# EAGLE design startlamp (EAGLE 8.3.2)
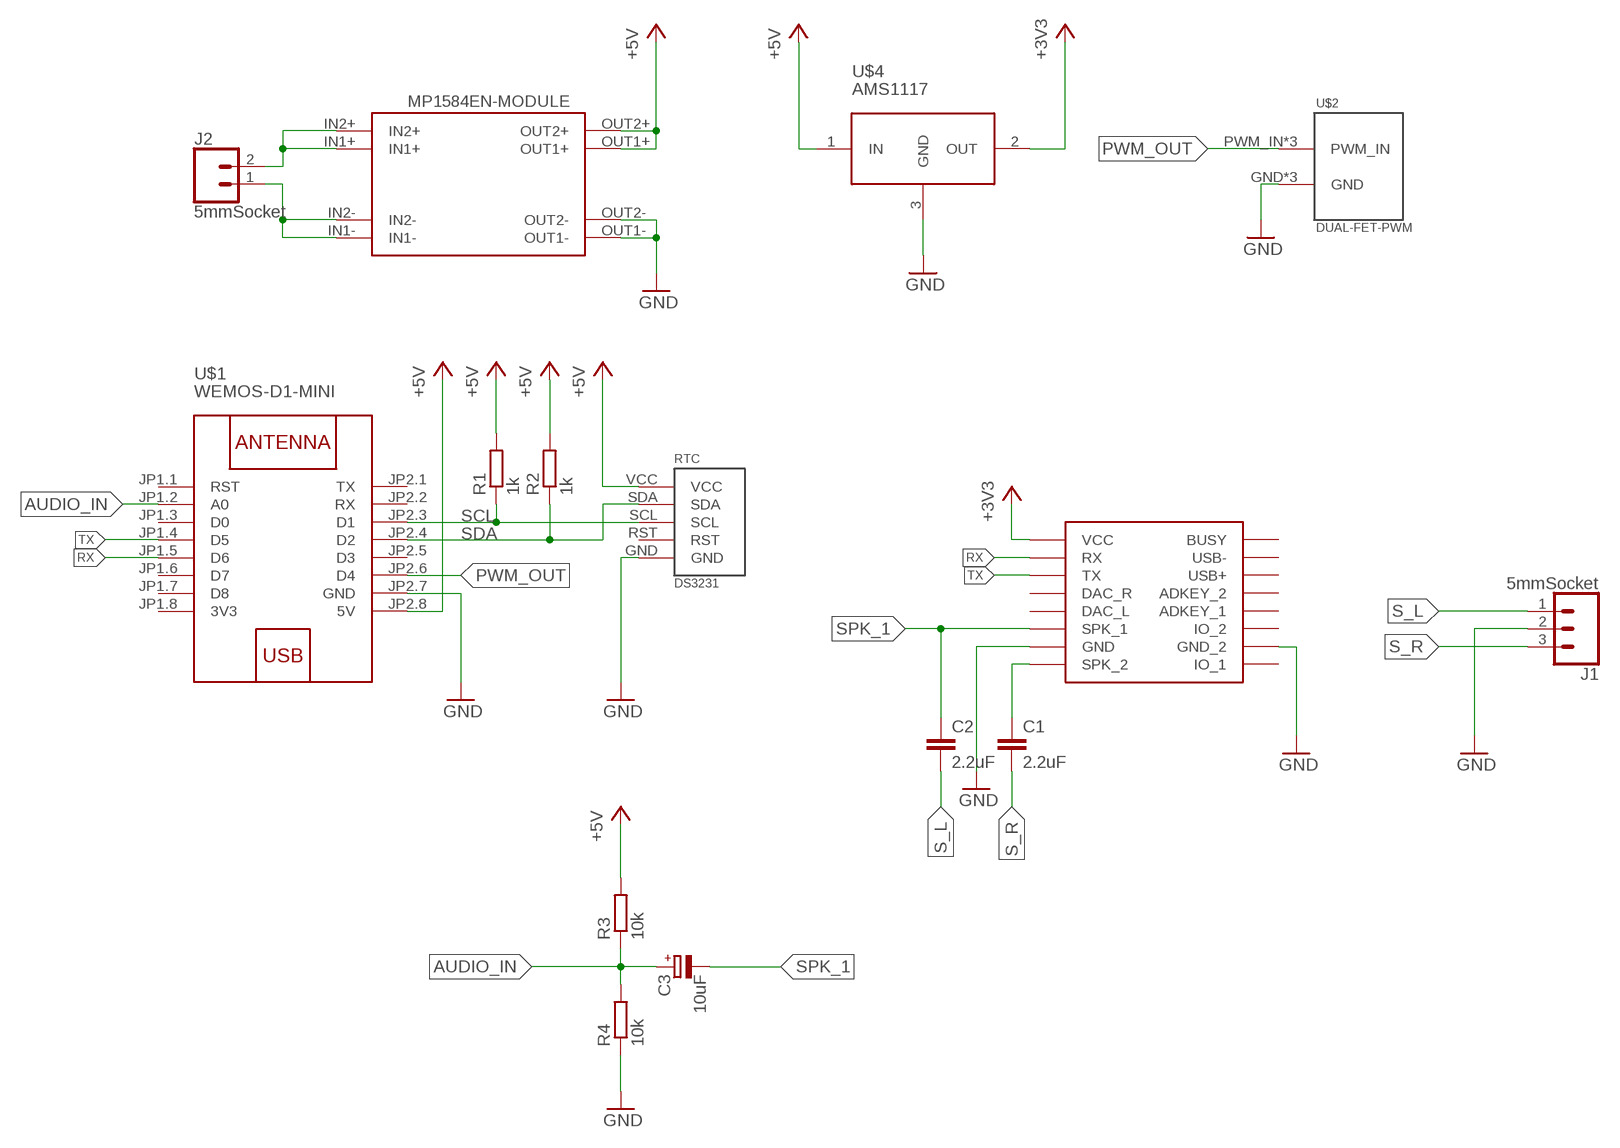
[diagram p0: schematic, sheet 1]

## Parts
C1  2.2uF  C-EU050-024X044  [C050-024X044]
C2  2.2uF  C-EU050-024X044  [C050-024X044]
C3  10uF  CPOL-EUE5-4  [E5-4]
J1  5mmSocket  CONN_03-SCREW-5MM  [SCREWTERMINAL-5MM-3]
J2  5mmSocket  CONN_025MM  [SCREWTERMINAL-5MM-2]
R1  1k  R-EU_0204/2V  [0204V]
R2  1k  R-EU_0204/2V  [0204V]
R3  10k  R-EU_0204/2V  [0204V]
R4  10k  R-EU_0204/2V  [0204V]
RTC  DS3231  RTC-MINI  [RTC-MINI]
U1  MP1584  MP1584EN-DC-DC-CONVERTOR  [DSUN_NEW]
U$1  WEMOS-D1-MINI  [WEMOS-D1-MINI]
U$2  DUAL-FET-PWM  [DUAL-FET-PWM]
U$3  DFPLAYER  [DFPLAYER]
U$4  AMS1117  REG-AMS1117-3P-3.3V#V  [REG-AMS1117-3P#V]

## Nets
+3V3: U$3.VCC U$4.2(OUT)
+5V: R1.2 R2.2 R3.2 RTC.VCC U1.OUT1+ U1.OUT2+ U$1.JP2.8(5V) U$4.1(IN)
AUDIO_IN: C3.+ R3.1 R4.2 U$1.JP1.2(A0)
GND: J1.2 R4.1 RTC.GND U1.OUT1- U1.OUT2- U$1.JP2.7(GND) U$2.GND U$2.GND2(GND) U$2.GND3(GND) U$3.GND U$3.GND_2 U$4.3(GND)
IN+: J2.2 U1.IN1+ U1.IN2+
IN-: J2.1 U1.IN1- U1.IN2-
PWM_OUT: U$1.JP2.6(D4) U$2.PWM_IN U$2.PWM_IN2(PWM_IN) U$2.PWM_IN3(PWM_IN)
RX: U$1.JP1.5(D6) U$3.RX
S_L: C2.2 J1.1
S_R: C1.2 J1.3
SCL: R1.1 RTC.SCL U$1.JP2.3(D1)
SDA: R2.1 RTC.SDA U$1.JP2.4(D2)
SPK_1: C2.1 C3.- U$3.SPK1(SPK_1)
SPK_2: C1.1 U$3.SPK2(SPK_2)
TX: U$1.JP1.4(D5) U$3.TX
Unconnected: RTC.RST U$1.JP1.1(RST) U$1.JP1.3(D0) U$1.JP1.6(D7) U$1.JP1.7(D8) U$1.JP2.1(TX) U$1.JP2.2(RX) U$1.JP2.5(D3) U$3.ADKEY1(ADKEY_1) U$3.ADKEY2(ADKEY_2) U$3.BUSY U$3.DAC_L U$3.DAC_R U$3.IO1(IO_1) U$3.IO2(IO_2) U$3.USB+ U$3.USB-

## Power pins joined to a net without a drawn wire
3V3: U$1.JP1.8(3V3)

## Library data of the parts
C1 C2 = rcl:C-EU: CAPACITOR, European symbol
C3 = rcl:CPOL-EU: POLARIZED CAPACITOR, European symbol
J1 = SparkFun-Connectors:CONN_03: Multi connection point. Often used as Generic Header-pin footprint for 0.1 inch spaced/style header connections On any of the 0.1 inch spaced packages, you can populate with these: Break Away Headers - Straight <https://www.sparkfun.com/products/116> (PRT-00116) Break Away Male Headers - Right Angle <https://www.sparkfun.com/products/553> (PRT-00553) Female Headers <https://www.sparkfun.com/products/115> (PRT-00115) Break Away Headers - Machine Pin <https://www.sparkfun.com/products/117> (PRT-00117) Break Away Female Headers - Swiss Machine Pin <https://www.sparkfun.com/products/743> (PRT-00743) Stackable Header - 3 Pin (Female, 0.1") <https://www.sparkfun.com/products/13875> (PRT-13875) For SCREWTERMINALS and SPRING TERMINALS visit here: Screw Terimnals on SparkFun.com <https://www.sparkfun.com/search/results?term=Screw+Terminals> (5mm/3.5mm/2.54mm spacing) This device is also useful as a general connection point to wire up your design to another part of your project. Our various solder wires solder well into these plated through hole pads. Hook-Up Wire - Assortment (Stranded, 22 AWG) <https://www.sparkfun.com/products/11375> (PRT-11375) Hook-Up Wire - Assortment (Solid Core, 22 AWG) <https://www.sparkfun.com/products/11367> (PRT-11367) View the entire wire category on our website here <https://www.sparkfun.com/categories/141> Special notes: Molex polarized connector foot print use with SKU : PRT-08232 with associated crimp pins and housings.; PROD_ID: CONN-10134; SF_SKU: PRT-08433
J2 = SparkFun-Connectors:CONN_02: Multi connection point. Often used as Generic Header-pin footprint for 0.1 inch spaced/style header connections On any of the 0.1 inch spaced packages, you can populate with these: Break Away Headers - Straight <https://www.sparkfun.com/products/116> (PRT-00116) Break Away Male Headers - Right Angle <https://www.sparkfun.com/products/553> (PRT-00553) Female Headers <https://www.sparkfun.com/products/115> (PRT-00115) Break Away Headers - Machine Pin <https://www.sparkfun.com/products/117> (PRT-00117) Break Away Female Headers - Swiss Machine Pin <https://www.sparkfun.com/products/743> (PRT-00743) For SCREWTERMINALS and SPRING TERMINALS visit here: Screw Terimnals on SparkFun.com <https://www.sparkfun.com/search/results?term=Screw+Terminals> (5mm/3.5mm/2.54mm spacing) This device is also useful as a general connection point to wire up your design to another part of your project. Our various solder wires solder well into these plated through hole pads. Hook-Up Wire - Assortment (Stranded, 22 AWG) <https://www.sparkfun.com/products/11375> (PRT-11375) Hook-Up Wire - Assortment (Solid Core, 22 AWG) <https://www.sparkfun.com/products/11367> (PRT-11367) View the entire wire category on our website here <https://www.sparkfun.com/categories/141> Special notes: Molex polarized connector foot print use with: PRT-08233 with associated crimp pins and housings. 2.54_SCREWTERM for use with PRT-10571. 3.5mm Screw Terminal footprints for PRT-08084 5mm Screw Terminal footprints for use with PRT-08432; SF_SKU: PRT-08432
R1-R4 = rcl:R-EU_: RESISTOR, European symbol
RTC = lights-wifi:RTC-MINI
U1 = lights-wifi:MP1584EN-DC-DC-CONVERTOR: FEATURES Wide 4.5V to 28V Operating Input Range Programmable Switching Frequency from 100kHz to 1.5MHz High-Efficiency Pulse Skipping Mode for Light Load Ceramic Capacitor Stable Internal Soft-Start Internally Set Current Limit without a Current Sensing Resistor Available in SOIC8E Package. APPLICATIONS High Voltage Power Conversion Automotive Systems Industrial Power Systems Distributed Power Systems
U$1 = lights-wifi:WEMOS-D1-MINI: WEMOS D1 mini: Mini Wi-Fi Board based on ESP-8266 device More details can be found here: https://www.wemos.cc/product/d1-mini.html Click here to find device on ebay.com <http://www.ebay.com/sch/wemos+d1+mini+nodemcu>
U$2 = lights-wifi:DUAL-FET-PWM
U$3 = lights-wifi:DFPLAYER
U$4 = lights-wifi:REG-AMS1117-3P-*: Linear Regulator based on AMS1117 chip 3-pin version AMS1117 datasheet is available here: http://www.advanced-monolithic.com/pdf/ds1117.pdf Click here to find device on ebay.com <http://www.ebay.com/sch/ams1117+module> Note: There are many variants. Search for the proper version.

## Board
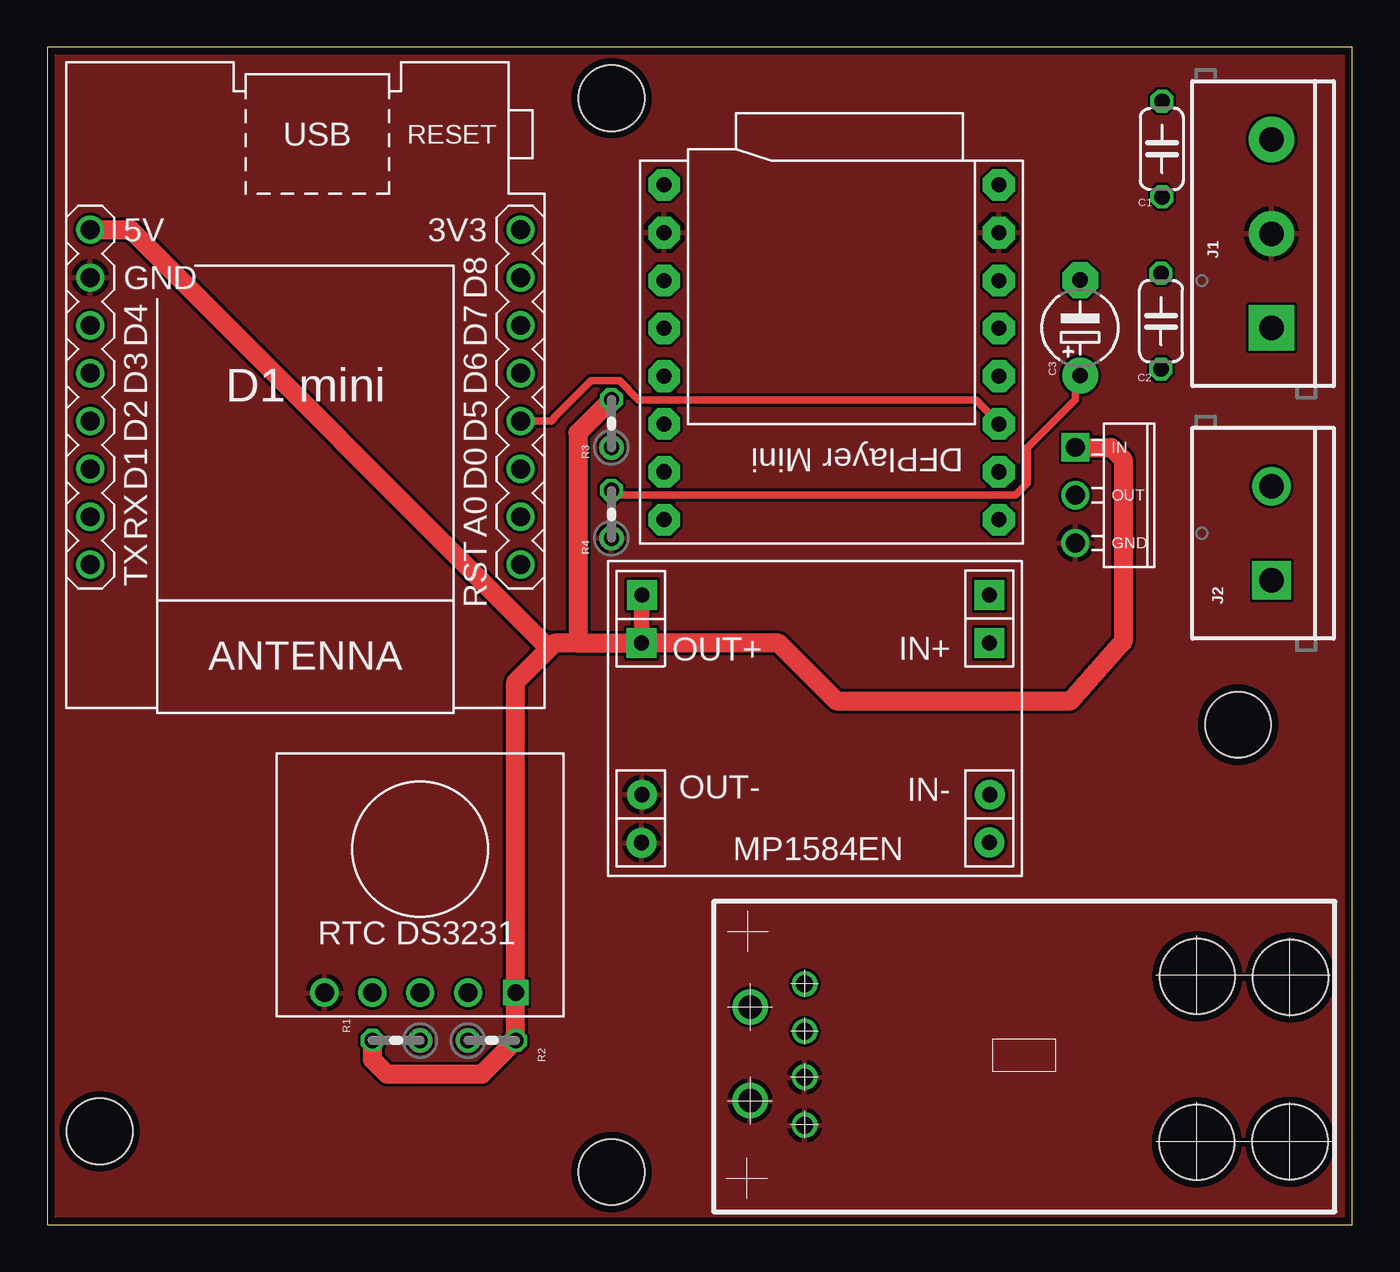
[diagram p1: board, top side]
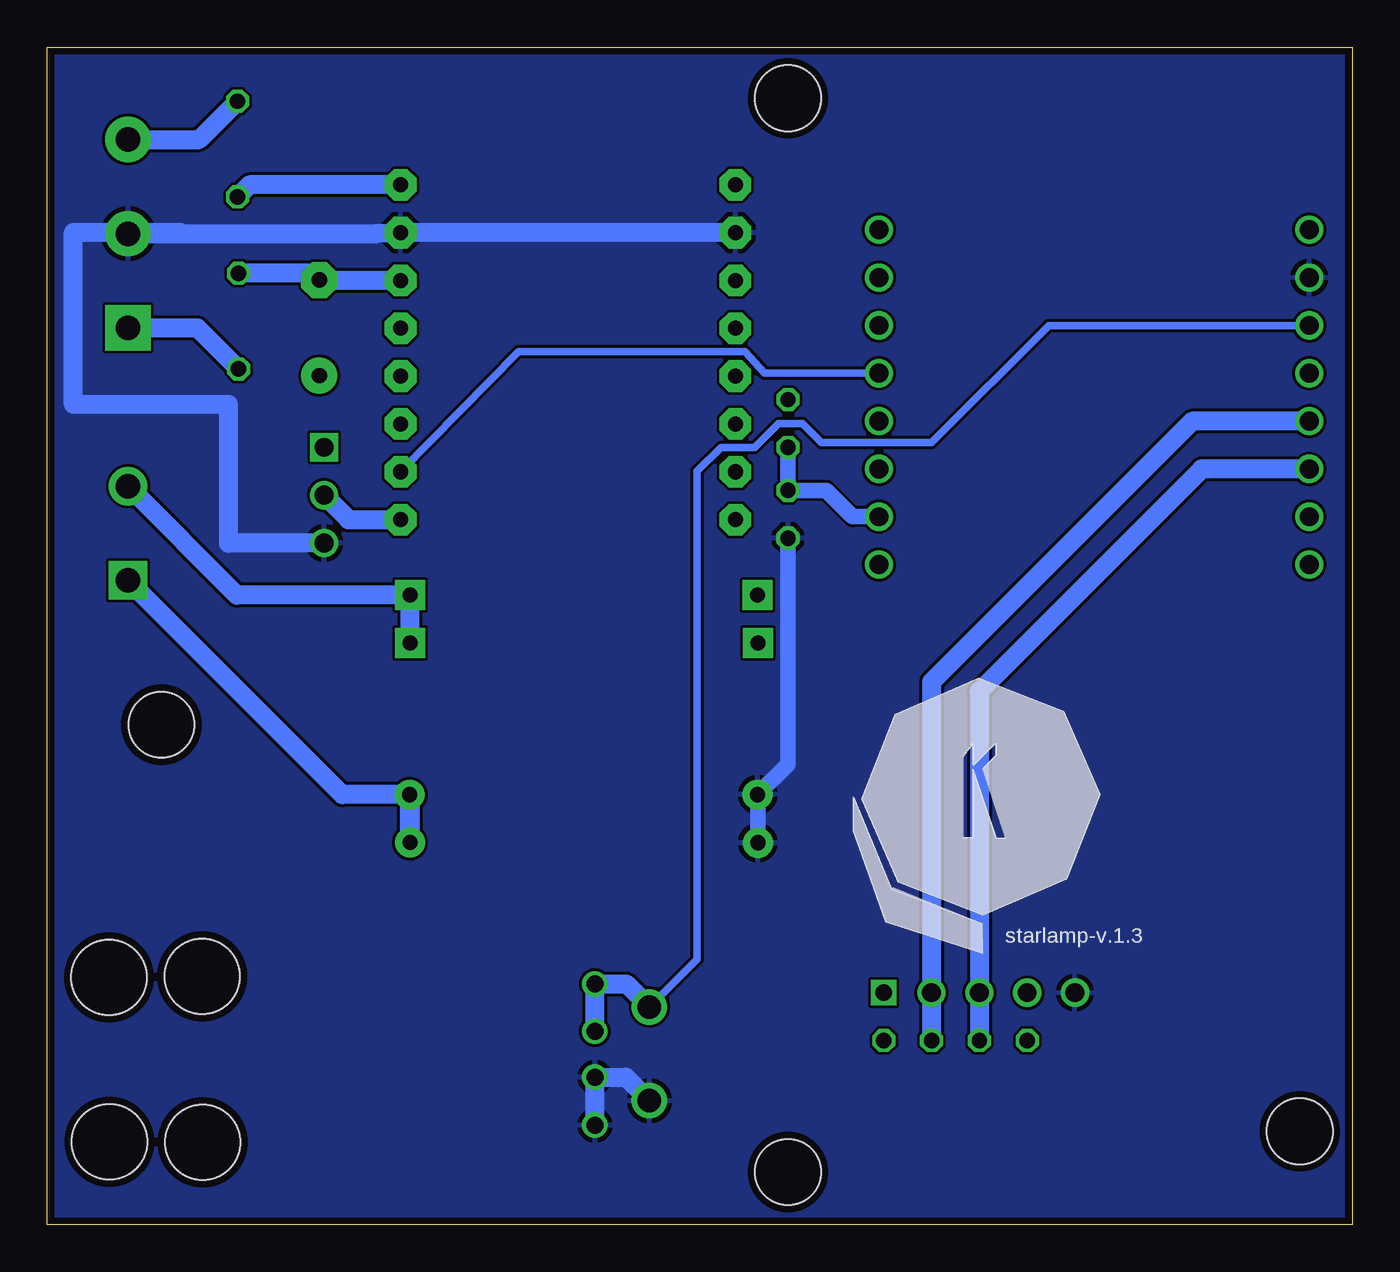
[diagram p2: board, bottom side, seen from below]

Size 69.32 x 62.54 mm. Coordinates in mm from the lower left corner, seen from the top.
Outline: 0,0 69.32,0 69.32,62.54 0,62.54 0,0
Copper layers (1*16): Top 0.0356mm / dielectric 1.5011mm / Bottom 0.0356mm
Design rules "oshpark-2layer": minimum track width 6mil, minimum drill 13mil, track to track 6mil, track to pad 6mil, pad to pad 6mil, via to via 6mil, smd to smd 6mil, copper to edge 15mil, drill to drill 6mil, minimum pad ring 7mil, minimum via ring 7mil, stop-mask expansion 2.5mil, vias tented up to drill 0mil, thermal gap 10mil
Holes 3.5 mm at 29.97,2.79 2.79,4.95 63.25,26.54 29.97,59.82

### Footprints (pad centres in the part's own frame; a part is rotated, then mirrored left to right if it is on the bottom)
C050-024X044 = drill 0.813 octagon: 1 -2.54,0; 2 2.54,0
E5-4 = drill 0.813 pad 1.905: + -2.54,0 | drill 0.813 pad 1.905 octagon: - 2.54,0
SCREWTERMINAL-5MM-3 = drill 1.3 pad 2.413 square: 1 0,0 | drill 1.3 pad 2.413: 2 5,0; 3 10,0
SCREWTERMINAL-5MM-2 = drill 1.3 pad 2.032 square: 1 0,0 | drill 1.3 pad 2.032: 2 5,0
0204V = drill 0.813 octagon: 1 -1.27,0; 2 1.27,0
RTC-MINI = drill 1: GND -1.27,1.27; RST -1.27,3.81; SCL -1.27,6.35; SDA -1.27,8.89 | drill 0.9 square: VCC -1.27,11.43
DSUN_NEW = drill 0.8 pad 1.59 square: IN1+ -9.4,-3.84; IN2+ -9.4,-6.38; OUT1+ 9.06,-3.83; OUT2+ 9.05,-6.38 | drill 0.8 pad 1.59: IN1- -9.41,6.76; IN2- -9.43,4.22; OUT1- 9.06,6.77; OUT2- 9.05,4.22
WEMOS-D1-MINI = drill 1: JP1.1 -11.43,9.525; JP1.2 -11.43,6.985; JP1.3 -11.43,4.445; JP1.4 -11.43,1.905; JP1.5 -11.43,-0.635; JP1.6 -11.43,-3.175; JP1.7 -11.43,-5.715; JP1.8 -11.43,-8.255; JP2.1 11.43,9.525; JP2.2 11.43,6.985; JP2.3 11.43,4.445; JP2.4 11.43,1.905; JP2.5 11.43,-0.635; JP2.6 11.43,-3.175; JP2.7 11.43,-5.715; JP2.8 11.43,-8.255
DUAL-FET-PWM = drill 1.25: GND 1.93,5.893; PWM_IN 1.93,10.871 | drill 0.9: GND2 4.826,7.137; GND3 4.826,4.597; PWM_IN2 4.826,12.09; PWM_IN3 4.826,9.576 | hole 4: 25.679,12.497; 30.632,12.446; 25.654,3.683; 30.607,3.708
DFPLAYER = drill 0.8 pad 1.676 octagon: ADKEY1 8.89,-1.27; ADKEY2 8.89,1.27; BUSY 8.89,8.89; DAC_L -8.89,-1.27; DAC_R -8.89,1.27; GND -8.89,-6.35; GND_2 8.89,-6.35; IO1 8.89,-8.89; IO2 8.89,-3.81; RX -8.89,6.35; SPK1 -8.89,-3.81; SPK2 -8.89,-8.89; TX -8.89,3.81; USB+ 8.89,3.81; USB- 8.89,6.35; VCC -8.89,8.89
REG-AMS1117-3P#V = drill 1 square: 1 -2.54,-1.27 | drill 1: 2 0,-1.27; 3 2.54,-1.27

### Placement (x,y rotation side)
C1  59.21,57.12 90 top
C2  59.16,47.98 270 top
C3  54.86,47.62 90 top
J1  65.02,47.62 90 top
J2  65.02,34.21 90 top
R1  18.54,9.78 180 top
R2  23.62,9.78 0 top
R3  29.97,42.55 90 top
R4  29.97,37.72 90 top
RTC  13.46,11.05 270 top
U1  40.64,27.05 180 top
U$1  13.72,44.58 180 top
U$2  35.41,0.69 0 top
U$3  41.66,46.33 180 top
U$4  55.88,38.73 270 top

### Tracks (layer width: path | path; a pad name or v marks a point on that pad's centre or on a via)
+3V3
  Bottom 1.016: U$4.2 53.31,37.44 U$3.VCC
+5V
  Top 0.813: U1.OUT1+ 31.58,33.42 U1.OUT2+
  Top 1.016: R1.2 17.27,8.76 18.03,8 23.11,8 R2.2 RTC.VCC 24.89,28.83 26.67,30.61 | 56.94,30.75 54.36,27.81 41.91,27.81 38.84,30.88 U1.OUT1+ 28.19,30.88 | 56.94,30.75 57.15,30.99 | U$1.JP2.8 4.45,52.83 26.67,30.61 | 28.19,30.88 26.94,30.88 26.67,30.61 | R3.2 28.19,42.04 28.19,30.88 | U$4.1 56.52,41.27 57.15,40.64 57.15,30.96 56.94,30.75
AUDIO_IN
  Top 0.406: C3.+ 54.86,44.7 54.61,44.45 54.61,43.81 52.07,41.27 52.07,39.37 51.44,38.73 30.23,38.73 R4.2
  Bottom 0.813: U$1.JP1.2 26.54,37.59 27.94,38.99 R4.2 R3.1
GND
  Bottom 0.813: U1.OUT1- 31.58,22.82 U1.OUT2- 29.97,24.45 R4.1
  Bottom 1.016: U$3.GND_2 U$3.GND 51.87,52.62 J1.2 62.23,52.7 67.92,52.7 67.92,43.56 59.69,43.56 59.69,36.2 U$4.3 | U$2.GND3 U$2.GND2 38.58,7.82 U$2.GND
  pour Bottom: 0.25,62.36 0.23,0.15 69.09,0.18 69.09,62.36
  pour Top: 0.25,62.36 69.09,62.36 69.09,0.18 0.23,0.15
IN+
  Bottom 1.016: U1.IN1+ U1.IN2+ 59.24,33.43 J2.2
IN-
  Bottom 1.016: U1.IN2- 50.05,22.81 U1.IN1- 50.07,20.29 U1.IN2- | U1.IN2- 53.64,22.83 J2.1
PWM_OUT
  Bottom 0.406: U$1.JP2.6 16.13,47.75 22.35,41.53 28.19,41.53 29.21,42.55 30.48,42.55 31.75,41.27 33.53,41.27 34.8,40.01 34.8,14.1 U$2.PWM_IN
  Bottom 1.016: U$2.PWM_IN3 U$2.PWM_IN2 38.56,12.78 U$2.PWM_IN
RX
  Bottom 0.406: U$1.JP1.5 31.23,45.21 32.27,46.36 44.27,46.36 U$3.RX
S_L
  Bottom 1.016: J1.1 61.34,47.62 C2.2
S_R
  Bottom 1.016: J1.3 61.25,57.62 C1.2
SCL
  Bottom 1.016: R1.1 RTC.SCL 19.81,28.32 8,40.13 U$1.JP2.3
SDA
  Bottom 1.016: U$1.JP2.4 8.51,42.67 22.35,28.83 RTC.SDA R2.1
SPK_1
  Bottom 1.016: 55.22,50.52 C2.1 | 55.22,50.52 C3.- | U$3.SPK1 54.84,50.14 55.22,50.52
SPK_2
  Bottom 1.016: U$3.SPK2 58.57,55.22 C1.1
TX
  Top 0.406: U$1.JP1.4 26.8,42.67 26.92,42.8 26.92,42.86 28.89,44.83 30.39,44.83 31.41,43.79 49.35,43.79 U$3.TX

### Text on the board
bNames: starlamp-v.1.3